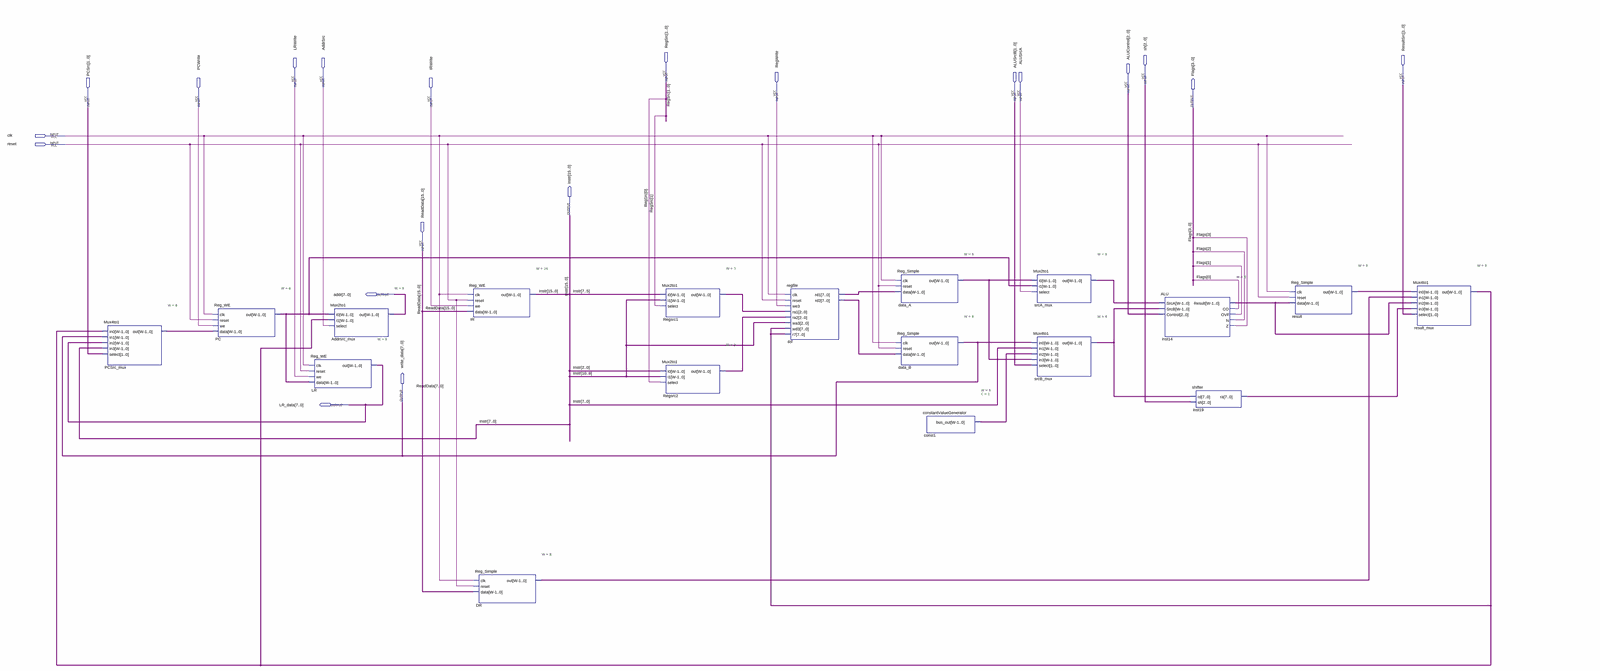
[diagram p0: schematic sheet, whole]
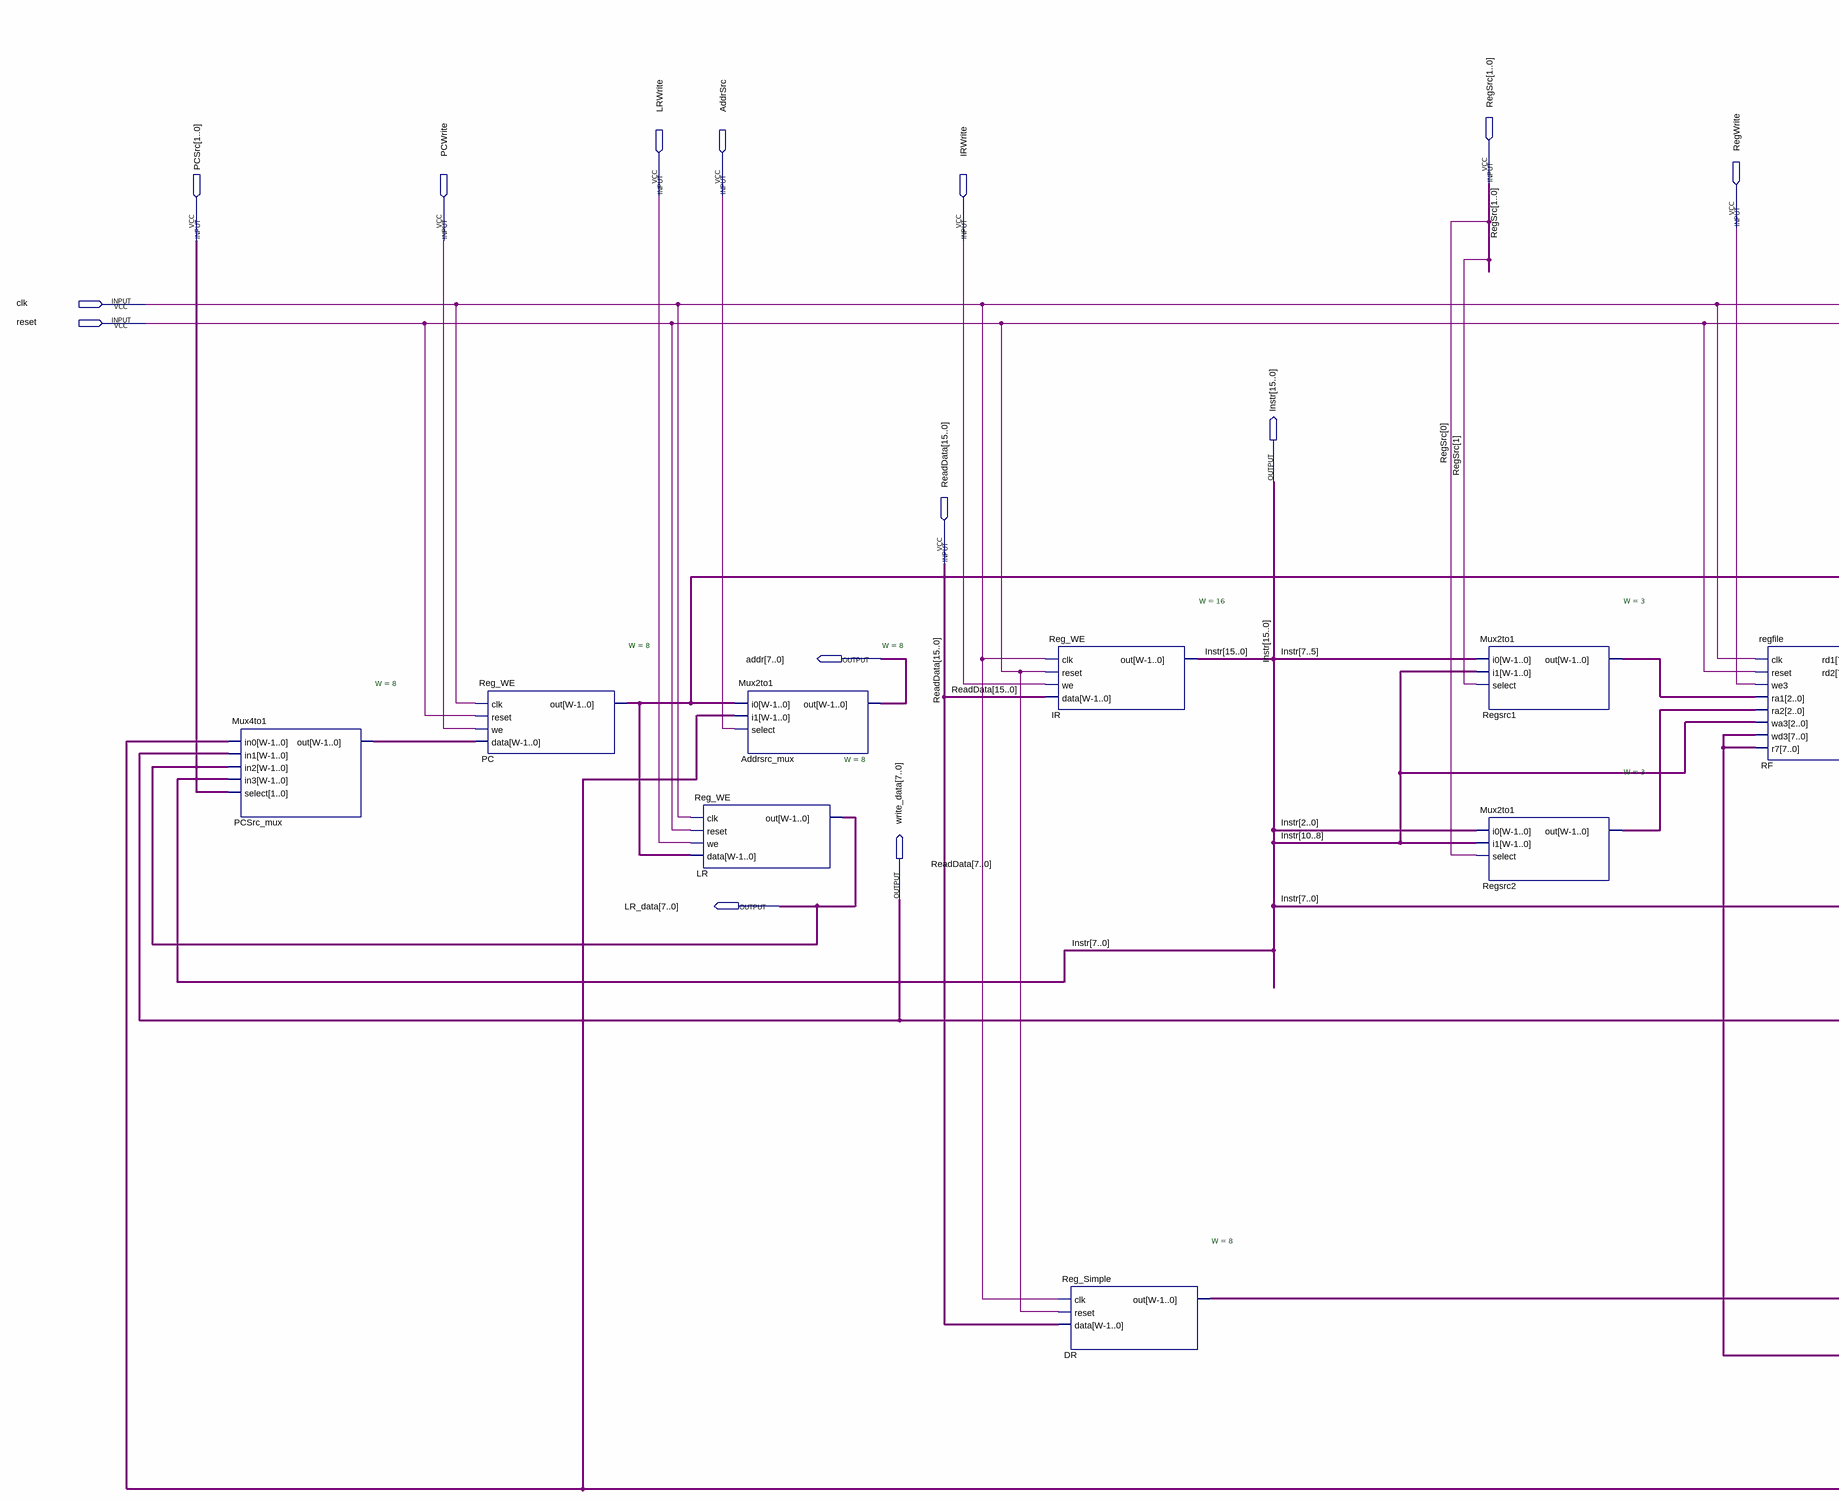
[diagram p1: schematic sheet, left part]
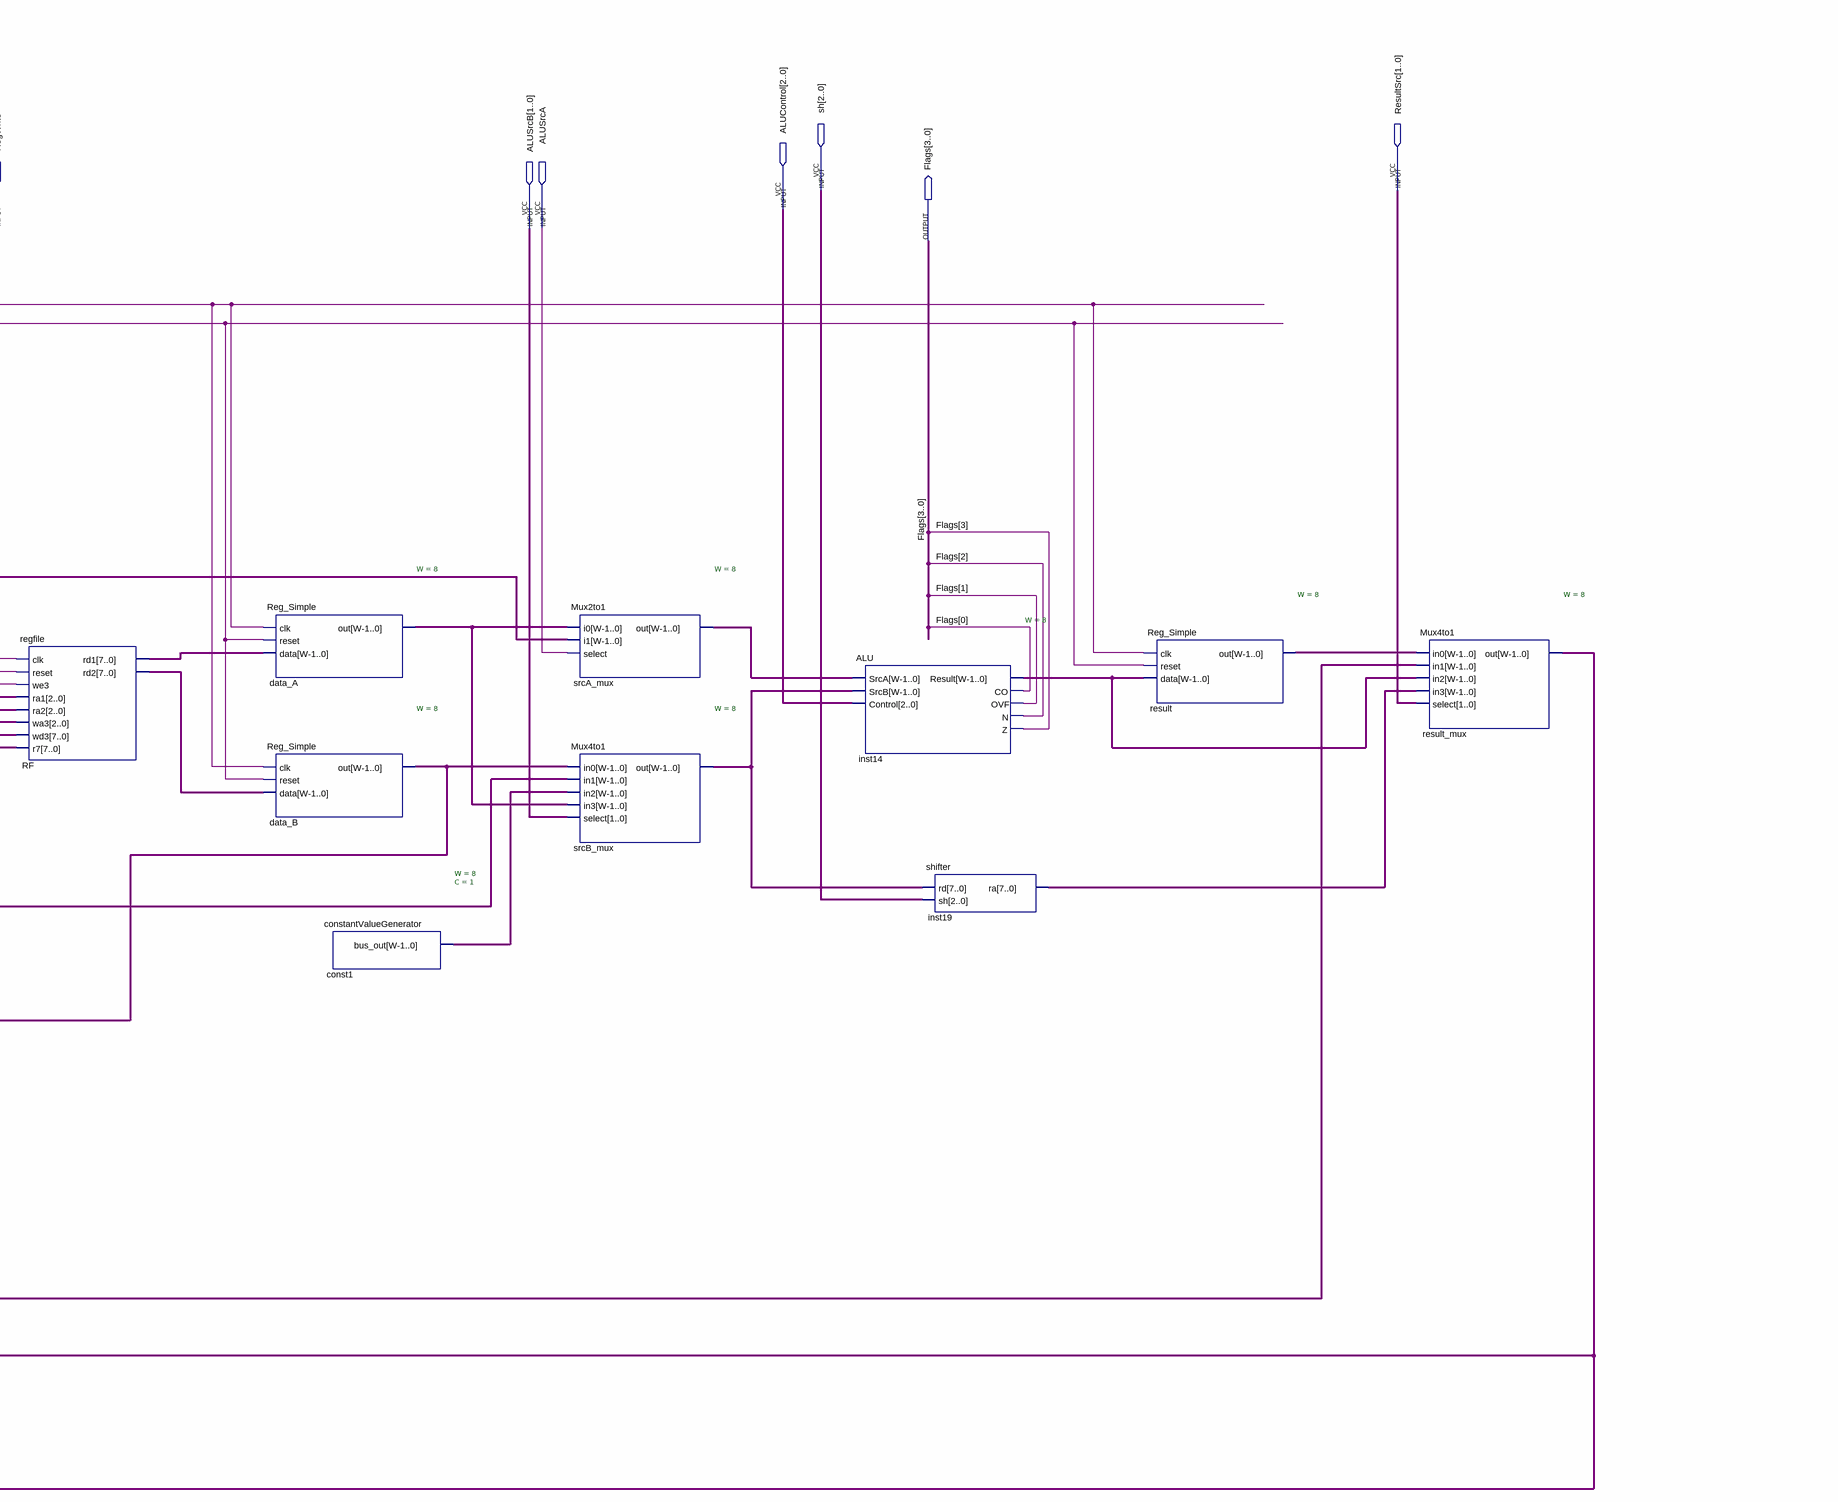
[diagram p2: schematic sheet, right part]
// Quartus schematic datapath.bdf as structural Verilog: 18 symbols, 20 pins
module datapath (
  input  [1:0] RegSrc,
  input  [2:0] sh,
  input  [1:0] ResultSrc,
  input  LRWrite,
  input  AddrSrc,
  input  [2:0] ALUControl,
  input  RegWrite,
  input  [1:0] ALUSrcB,
  input  ALUSrcA,
  input  [1:0] PCSrc,
  input  PCWrite,
  input  IRWrite,
  input  clk,
  input  reset,
  input  [15:0] ReadData,
  output [3:0] Flags,
  output [15:0] Instr,
  output [7:0] addr,
  output [7:0] write_data,
  output [7:0] LR_data
);

  wire [2:0] Regsrc1_out, Regsrc2_out;
  wire [7:0] const1_bus_out, data_A_out, DR_out, inst14_result, inst19_ra, PC_out, PCSrc_mux_out,
       result_mux_out, result_out, RF_rd1, RF_rd2, srcA_mux_out, srcB_mux_out;

  Mux4to1 #(.W(8)) PCSrc_mux (
    .in0(result_mux_out), .in1(write_data), .in2(LR_data), .in3(Instr[7:0]), .select(PCSrc),
    .out(PCSrc_mux_out));
  Reg_WE #(.W(8)) PC (.clk(clk), .reset(reset), .we(PCWrite), .data(PCSrc_mux_out), .out(PC_out));
  Reg_WE #(.W(8)) LR (.clk(clk), .reset(reset), .we(LRWrite), .data(PC_out), .out(LR_data));
  Mux2to1 #(.W(8)) Addrsrc_mux (.i0(PC_out), .i1(result_mux_out), .select(AddrSrc), .out(addr));
  Reg_WE #(.W(16)) IR (.clk(clk), .reset(reset), .we(IRWrite), .data(ReadData), .out(Instr));
  Reg_Simple #(.W(8)) DR (.clk(clk), .reset(reset), .data(ReadData[7:0]), .out(DR_out));
  Mux2to1 #(.W(3)) Regsrc1 (.i0(Instr[7:5]), .i1(Instr[10:8]), .select(RegSrc[1]), .out(Regsrc1_out));
  Mux2to1 #(.W(3)) Regsrc2 (.i0(Instr[2:0]), .i1(Instr[10:8]), .select(RegSrc[0]), .out(Regsrc2_out));
  regfile RF (
    .clk(clk), .reset(reset), .we3(RegWrite), .ra1(Regsrc1_out), .ra2(Regsrc2_out), .wa3(Instr[10:8]),
    .wd3(result_mux_out), .r7(result_mux_out), .rd1(RF_rd1), .rd2(RF_rd2));
  Reg_Simple #(.W(8)) data_A (.clk(clk), .reset(reset), .data(RF_rd1), .out(data_A_out));
  Reg_Simple #(.W(8)) data_B (.clk(clk), .reset(reset), .data(RF_rd2), .out(write_data));
  constantValueGenerator #(.W(8), .C(1)) const1 (.bus_out(const1_bus_out));
  Mux2to1 #(.W(8)) srcA_mux (.i0(data_A_out), .i1(PC_out), .select(ALUSrcA), .out(srcA_mux_out));
  Mux4to1 #(.W(8)) srcB_mux (
    .in0(write_data), .in1(Instr[7:0]), .in2(const1_bus_out), .in3(data_A_out), .select(ALUSrcB),
    .out(srcB_mux_out));
  ALU #(.W(8)) inst14 (
    .SrcA(srcA_mux_out), .SrcB(srcB_mux_out), .Control(ALUControl), .Result(inst14_result), .CO(Flags[0]),
    .OVF(Flags[1]), .N(Flags[2]), .Z(Flags[3]));
  shifter inst19 (.rd(srcB_mux_out), .sh(sh), .ra(inst19_ra));
  Reg_Simple #(.W(8)) result (.clk(clk), .reset(reset), .data(inst14_result), .out(result_out));
  Mux4to1 #(.W(8)) result_mux (
    .in0(result_out), .in1(DR_out), .in2(inst14_result), .in3(inst19_ra), .select(ResultSrc),
    .out(result_mux_out));
endmodule
